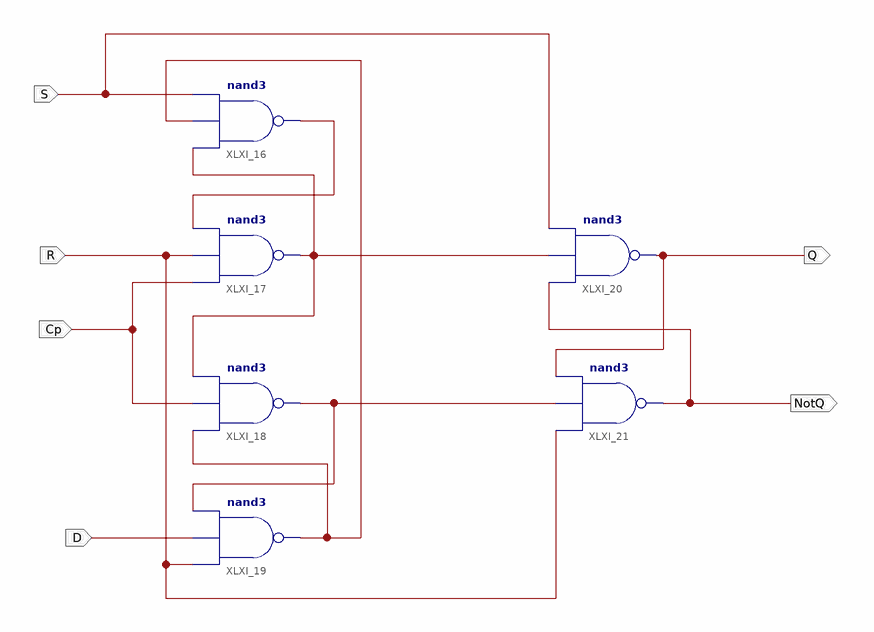
[diagram p0: schematic sheet 1]
// Xilinx ISE schematic D_FlipFlop.sch (kintex7) as structural Verilog: 6 symbols, 6 ports
module D_FlipFlop (
  input  D,
  input  Cp,
  input  S,
  input  R,
  output NotQ,
  output Q
);

  wire XLXN_3, XLXN_5, XLXN_7, XLXN_15;

  nand XLXI_16 (XLXN_3, XLXN_5, XLXN_7, S);
  nand XLXI_17 (XLXN_5, Cp, R, XLXN_3);
  nand XLXI_18 (XLXN_15, XLXN_7, Cp, XLXN_5);
  nand XLXI_19 (XLXN_7, R, D, XLXN_15);
  nand XLXI_20 (Q, NotQ, XLXN_5, S);
  nand XLXI_21 (NotQ, R, XLXN_15, Q);
endmodule
